# Altium schematic sheet T1_Card_Top.SchDoc
size 431 x 279 mm; Date: Not shown in title block; ApprovedBy: Not shown in title block; CheckedBy: Not shown in title block; Author: Not shown in title block; CompanyName: Not shown in title block; DrawnBy: Andy Lin (TI); Engineer: Not shown in title block; Organization: Not shown in title block; Address1: Not shown in title block; Address2: Not shown in title block; Address3: Not shown in title block; Address4: Not shown in title block; DocumentNumber: 2; Revision: Use project parameter SCH_Rev; SheetNumber: 2; SheetTotal: 14; PageSetup: Record=PageOptions|CenterHorizontal=True|CenterVertical=True|PrintScale=1.00|XCorrection=1.00|YCorrection=1.00|PrintKind=0|BorderSize=5000000|LeftOffset=0|BottomOffset=0|Orientation=2|PaperLength=1000|PaperWidth=1000|Scale=100|PaperSource=15|PrintQuality=600|MediaType=1|DitherType=10|PaperKind=Letter|PrintScaleMode=1; CurrentTime: Not shown in title block; CurrentDate: Not shown in title block; Time: Not shown in title block; DocumentFullPathAndName: Not shown in title block; DocumentName: Not shown in title block; ModifiedDate: Not shown in title block; ImagePath: Not shown in title block
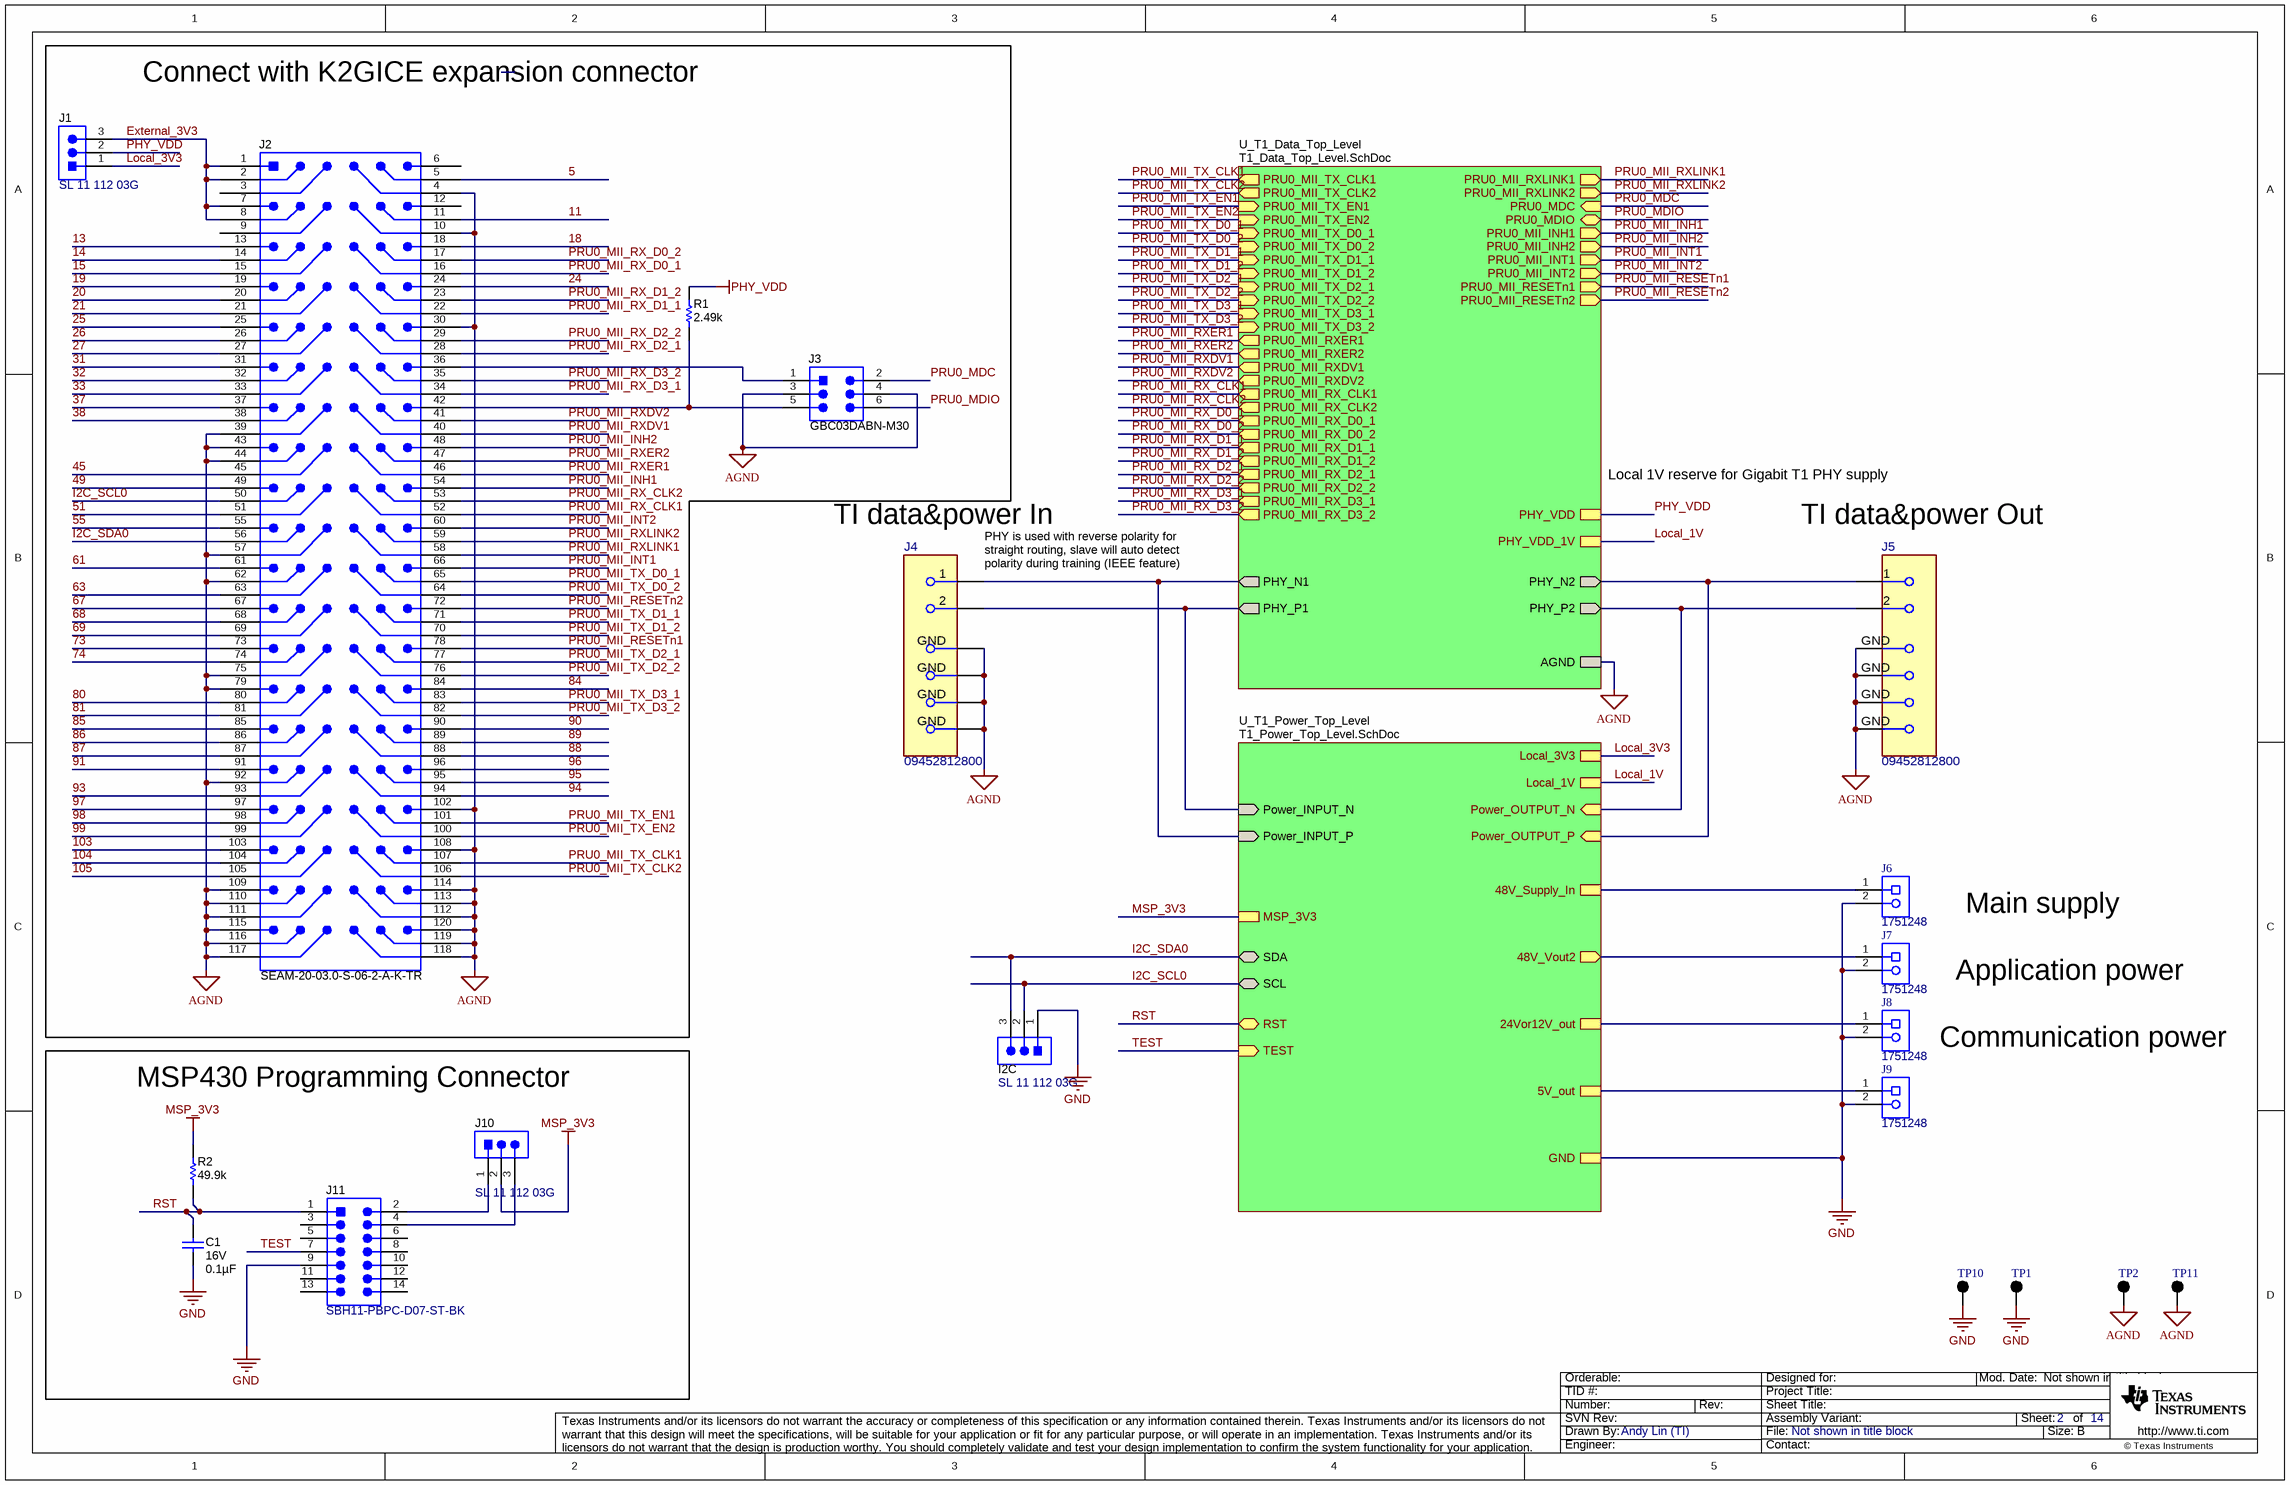
[diagram p0: T1_Card_Top.SchDoc]

## Parts
C1  VDC_V: 16V  ValueDisplayed: 0.1µF  [0402]  (hidden comment: GCM155R71C104JA55D)
I2C  SL 11 112 03G  [Fischer_SL-11-112-03G]
J1  SL 11 112 03G  [Fischer_SL-11-112-03G]
J2  SEAM-20-03.0-S-06-2-A-K-TR  [Samtec_SEAM-20-03_0-x-06-2-A-K]
J3  GBC03DABN-M30  [Sullins_GBC03DABN-M30]
J4  09452812800  [FP-09452812800_HDR2-MFG]
J5  09452812800  [FP-09452812800_HDR2-MFG]
J6  1751248  [CONN_1751248]
J7  1751248  [CONN_1751248]
J8  1751248  [CONN_1751248]
J9  1751248  [CONN_1751248]
J10  SL 11 112 03G  [Fischer_SL-11-112-03G]
J11  SBH11-PBPC-D07-ST-BK  [CONN_SBH11-PBPC-D07-ST-BK]
R1  ValueDisplayed: 2.49k  [0402]  (hidden comment: CRCW04022K49FKED)
R2  ValueDisplayed: 49.9k  [0402]  (hidden comment: CRCW040249K9FKED)
TP1  5001  [Keystone5001]  (value not drawn)
TP2  5001  [Keystone5001]  (value not drawn)
TP10  5001  [Keystone5001]  (value not drawn)
TP11  5001  [Keystone5001]  (value not drawn)

## Blocks framed on the sheet
Connect with K2GICE expansion connector: J1-J3 R1
MSP430 Programming Connector: C1 J10 J11 R2

## Sub-sheets
U_T1_Data_Top_Level = T1_Data_Top_Level.SchDoc: PHY_P1 (out), PHY_P2 (out), PHY_N1 (out), PHY_N2 (out), AGND, PHY_VDD, PRU0_MII_TX_D0_2 (in), PRU0_MII_TX_EN2 (in), PRU0_MII_TX_CLK1 (out), PRU0_MII_TX_D1_1 (in), PRU0_MII_TX_D1_2 (in), PRU0_MII_TX_CLK2 (out), PRU0_MII_TX_D0_1 (in), PRU0_MII_TX_EN1 (in), PRU0_MII_TX_D3_1 (in), PRU0_MII_TX_D3_2 (in), PRU0_MII_TX_D2_1 (in), PRU0_MII_TX_D2_2 (in), PRU0_MII_RXDV2 (out), PRU0_MII_RX_D2_1 (out), PRU0_MII_RXDV1 (out), PRU0_MII_RX_D0_1 (out), PRU0_MII_RX_D2_2 (out), PRU0_MII_RX_D3_1 (out), PRU0_MII_RX_D3_2 (out), PRU0_MII_RX_CLK1 (out), PRU0_MII_RX_D1_1 (out), PRU0_MII_RX_D1_2 (out), PRU0_MII_RXER1 (out), PRU0_MII_RX_D0_2 (out), PRU0_MII_RX_CLK2 (out), PRU0_MII_RXER2 (out), PRU0_MII_INT2 (out), PRU0_MII_INH1 (out), PRU0_MDC (in), PRU0_MII_INH2 (out), PRU0_MII_RESETn2 (out), PRU0_MII_RXLINK2 (out), PRU0_MDIO (bidir), PRU0_MII_RXLINK1 (out), PRU0_MII_INT1 (out), PRU0_MII_RESETn1 (out), PHY_VDD_1V
U_T1_Power_Top_Level = T1_Power_Top_Level.SchDoc: SCL (bidir), SDA (bidir), Power_INPUT_P (in), Power_INPUT_N (in), GND, Power_OUTPUT_P (in), Power_OUTPUT_N (in), 48V_Vout2 (out), RST (bidir), TEST (in), 24Vor12V_out, 5V_out, 48V_Supply_In, MSP_3V3, Local_3V3, Local_1V

## Nets
AGND: J2.4 J2.10 J2.30 J2.39 J2.43 J2.44 J2.57 J2.62 J2.75 J2.79 J2.92 J2.102 J2.108 J2.109 J2.110 J2.111 J2.112 J2.113 J2.114 J2.115 J2.116 J2.117 J2.118 J2.119 J2.120 J3.3 J3.4 J4.3(GND) J4.4(GND) J4.5(GND) J4.6(GND) J5.3(GND) J5.4(GND) J5.5(GND) J5.6(GND) TP2.1 TP11.1 ; sheet U_T1_Data_Top_Level/AGND
GND: C1.2 I2C.1 J6.2 J7.2 J8.2 J9.2 J11.9 TP1.1 TP10.1 ; sheet U_T1_Power_Top_Level/GND
MSP_3V3: J10.2 R2.2 ; sheet U_T1_Power_Top_Level/MSP_3V3
PHY_VDD: J1.2 R1.2 ; sheet U_T1_Data_Top_Level/PHY_VDD
5: J2.5
11: J2.11
13: J2.13
14: J2.14
15: J2.15
18: J2.18
19: J2.19
20: J2.20
21: J2.21
24: J2.24
25: J2.25
26: J2.26
27: J2.27
31: J2.31
32: J2.32
33: J2.33
37: J2.37
38: J2.38
45: J2.45
49: J2.49
51: J2.51
55: J2.55
61: J2.61
63: J2.63
67: J2.67
68: J2.68
69: J2.69
73: J2.73
74: J2.74
80: J2.80
81: J2.81
84: J2.84
85: J2.85
86: J2.86
87: J2.87
88: J2.88
89: J2.89
90: J2.90
91: J2.91
93: J2.93
94: J2.94
95: J2.95
96: J2.96
97: J2.97
98: J2.98
99: J2.99
103: J2.103
104: J2.104
105: J2.105
External_3V3: J1.3 J2.1 J2.2 J2.7 J2.8
I2C_SCL0: I2C.2 J2.50 ; sheet U_T1_Power_Top_Level/SCL
I2C_SDA0: I2C.3 J2.56 ; sheet U_T1_Power_Top_Level/SDA
Local_1V: sheet U_T1_Power_Top_Level/Local_1V, sheet U_T1_Data_Top_Level/PHY_VDD_1V
Local_3V3: J1.1 ; sheet U_T1_Power_Top_Level/Local_3V3
PRU0_MDC: J3.2 ; sheet U_T1_Data_Top_Level/PRU0_MDC
PRU0_MDIO: J3.6 ; sheet U_T1_Data_Top_Level/PRU0_MDIO
PRU0_MII_INH1: J2.54 ; sheet U_T1_Data_Top_Level/PRU0_MII_INH1
PRU0_MII_INH2: J2.48 ; sheet U_T1_Data_Top_Level/PRU0_MII_INH2
PRU0_MII_INT1: J2.66 ; sheet U_T1_Data_Top_Level/PRU0_MII_INT1
PRU0_MII_INT2: J2.60 ; sheet U_T1_Data_Top_Level/PRU0_MII_INT2
PRU0_MII_RESETn1: J2.78 ; sheet U_T1_Data_Top_Level/PRU0_MII_RESETn1
PRU0_MII_RESETn2: J2.72 ; sheet U_T1_Data_Top_Level/PRU0_MII_RESETn2
PRU0_MII_RX_CLK1: J2.52 ; sheet U_T1_Data_Top_Level/PRU0_MII_RX_CLK1
PRU0_MII_RX_CLK2: J2.53 ; sheet U_T1_Data_Top_Level/PRU0_MII_RX_CLK2
PRU0_MII_RX_D0_1: J2.16 ; sheet U_T1_Data_Top_Level/PRU0_MII_RX_D0_1
PRU0_MII_RX_D0_2: J2.17 ; sheet U_T1_Data_Top_Level/PRU0_MII_RX_D0_2
PRU0_MII_RX_D1_1: J2.22 ; sheet U_T1_Data_Top_Level/PRU0_MII_RX_D1_1
PRU0_MII_RX_D1_2: J2.23 ; sheet U_T1_Data_Top_Level/PRU0_MII_RX_D1_2
PRU0_MII_RX_D2_1: J2.28 ; sheet U_T1_Data_Top_Level/PRU0_MII_RX_D2_1
PRU0_MII_RX_D2_2: J2.29 ; sheet U_T1_Data_Top_Level/PRU0_MII_RX_D2_2
PRU0_MII_RX_D3_1: J2.34 ; sheet U_T1_Data_Top_Level/PRU0_MII_RX_D3_1
PRU0_MII_RX_D3_2: J2.35 ; sheet U_T1_Data_Top_Level/PRU0_MII_RX_D3_2
PRU0_MII_RXDV1: J2.40 ; sheet U_T1_Data_Top_Level/PRU0_MII_RXDV1
PRU0_MII_RXDV2: J2.41 ; sheet U_T1_Data_Top_Level/PRU0_MII_RXDV2
PRU0_MII_RXER1: J2.46 ; sheet U_T1_Data_Top_Level/PRU0_MII_RXER1
PRU0_MII_RXER2: J2.47 ; sheet U_T1_Data_Top_Level/PRU0_MII_RXER2
PRU0_MII_RXLINK1: J2.58 ; sheet U_T1_Data_Top_Level/PRU0_MII_RXLINK1
PRU0_MII_RXLINK2: J2.59 ; sheet U_T1_Data_Top_Level/PRU0_MII_RXLINK2
PRU0_MII_TX_CLK1: J2.107 ; sheet U_T1_Data_Top_Level/PRU0_MII_TX_CLK1
PRU0_MII_TX_CLK2: J2.106 ; sheet U_T1_Data_Top_Level/PRU0_MII_TX_CLK2
PRU0_MII_TX_D0_1: J2.65 ; sheet U_T1_Data_Top_Level/PRU0_MII_TX_D0_1
PRU0_MII_TX_D0_2: J2.64 ; sheet U_T1_Data_Top_Level/PRU0_MII_TX_D0_2
PRU0_MII_TX_D1_1: J2.71 ; sheet U_T1_Data_Top_Level/PRU0_MII_TX_D1_1
PRU0_MII_TX_D1_2: J2.70 ; sheet U_T1_Data_Top_Level/PRU0_MII_TX_D1_2
PRU0_MII_TX_D2_1: J2.77 ; sheet U_T1_Data_Top_Level/PRU0_MII_TX_D2_1
PRU0_MII_TX_D2_2: J2.76 ; sheet U_T1_Data_Top_Level/PRU0_MII_TX_D2_2
PRU0_MII_TX_D3_1: J2.83 ; sheet U_T1_Data_Top_Level/PRU0_MII_TX_D3_1
PRU0_MII_TX_D3_2: J2.82 ; sheet U_T1_Data_Top_Level/PRU0_MII_TX_D3_2
PRU0_MII_TX_EN1: J2.101 ; sheet U_T1_Data_Top_Level/PRU0_MII_TX_EN1
PRU0_MII_TX_EN2: J2.100 ; sheet U_T1_Data_Top_Level/PRU0_MII_TX_EN2
RST: C1.1 J11.1 R2.1 ; sheet U_T1_Power_Top_Level/RST
TEST: J11.7 ; sheet U_T1_Power_Top_Level/TEST
NetJ2_36: J2.36 J3.1
NetJ2_42: J2.42 J3.5 R1.1
NetJ4_1: J4.1 ; sheet U_T1_Power_Top_Level/Power_INPUT_P, sheet U_T1_Data_Top_Level/PHY_N1
NetJ4_2: J4.2 ; sheet U_T1_Power_Top_Level/Power_INPUT_N, sheet U_T1_Data_Top_Level/PHY_P1
NetJ5_1: J5.1 ; sheet U_T1_Power_Top_Level/Power_OUTPUT_P, sheet U_T1_Data_Top_Level/PHY_N2
NetJ5_2: J5.2 ; sheet U_T1_Power_Top_Level/Power_OUTPUT_N, sheet U_T1_Data_Top_Level/PHY_P2
NetJ6_1: J6.1 ; sheet U_T1_Power_Top_Level/48V_Supply_In
NetJ7_1: J7.1 ; sheet U_T1_Power_Top_Level/48V_Vout2
NetJ8_1: J8.1 ; sheet U_T1_Power_Top_Level/24Vor12V_out
NetJ9_1: J9.1 ; sheet U_T1_Power_Top_Level/5V_out
NetJ10_1: J10.1 J11.2
NetJ10_3: J10.3 J11.4

Not connected (* = marked no-connect by the designer): J2 3 6 9 12; J11 3 5 6 8 10 11 12 13 14

## Notes on the sheet
- Local 1V reserve for Gigabit T1 PHY supply
- (near J4) TI data&power In
- (near J4) PHY is used with reverse polarity for straight routing, slave will auto detect polarity during training (IEEE feature)
- (near J5) TI data&power Out
- Main supply
- Application power
- Communication power
- Drawn By:
- SVN Rev:
- Number:
- TID #:
- Orderable:
- Rev:
- Sheet Title:
- File:
- Project Title:
- Designed for:
- Assembly Variant:
- Mod. Date:
- Sheet:
- Size:
- of
- B
- http://www.ti.com
- Texas Instruments and/or its licensors do not warrant the accuracy or completeness of this specification or any information contained therein. Texas Instruments and/or its licensors do not warrant that this design will meet the specifications, will be suitable for your application or fit for any particular purpose, or will operate in an implementation. Texas Instruments and/or its licensors do not warrant that the design is production worthy. You should completely validate and test your design implementation to confirm the system functionality for your application.
- Engineer:
- Contact:
- © Texas Instruments

## Library data of the parts
C1 = CMP-0080702-1: CAP, CERM, 0.1 µF, 16 V,+/- 5%, X7R, AEC-Q200 Grade 1, 0402; Manufacturer: MuRata; Cap_F: 100nF; SizeAreaWB_mm2: 3; SizeArea_mm2: 0.5; AEC Qualified: Y; AEC Category: Q200; Value: 0.1uF; TaMax_C: 125°C; SizeZ_mm: 0.6; AEC Grade: 1; Polarized: N; TaMin_C: -55°C; U/M: EA; ComponentLink1Description: Datasheet link; RoHS: Y; Tolerance_%: 5%; Supplier 1: Digi-Key; PackageReference: 0402; Technology: Ceramic; PartNumber: GCM155R71C104JA55D; TempCo: X7R; Supplier Part Number 2: 81-GCM155R71C104JA5D; Supplier 2: Mouser; SizeY_mm: 0.5; Value2: 16V; ComponentLink1URL: https://search.murata.co.jp/Ceramy/image/img/A01X/G101/ENG/GCM155R71C104JA55-01.pdf; CompType: Capacitor; MountType: SMT; Supplier Part Number 1: 490-16433-1-ND; SizeX_mm: 1; Cap_Case: 0402
I2C J1 J10 = CMP-0075048-1: Header, 2.54mm, 3x1, Gold, TH; Manufacturer: Fischer Elektronik; CT: False; CNHeader: True; ComponentLink1URL: http://www.fischerelektronik.de/web_fischer/public/index.xhtml; Publisher: Texas Instruments; CompType: Header; PackageReference: TH, 3-Leads, Body 2.5x7.62mm, Pitch 2.54mm; LatestRevisionDate: 2017-07-12; ClassName: Header; MountType: TH; PartNumber: SL 11 112 03G; ComponentLink1Description: Datasheet URL
J2 = CMP-0075646-1: Header(shrouded), 1.27mm, 20x6, Gold, SMT; Manufacturer: Samtec; Gender: Male; Cert_UL: Y; Current_A: 1.8A; Voltage_V: 240V; CT: False; Row_Count: 6; ComponentLink1Description: Datasheet URL; RoHS: Y; Orientation: Vertical; PackageReference: Header(shrouded), 1.27mm, 20x6, SMT; Color: Black; PartNumber: SEAM-20-03.0-S-06-2-A-K-TR; PinCount: 120; Publisher: Texas Instruments; ContactFinish: Gold; Shrouded: Y; ComponentLink1URL: http://suddendocs.samtec.com/catalog_english/seam.pdf; LatestRevisionDate: 2017-07-12; CompType: Header; CNHeader: False; MountType: SMT
J3 = CMP-0054609-2: Header, 2.54mm, 3x2, Gold, Black, SMT; Manufacturer: Sullins Connector Solutions; Shrouded: N; Gender: Male; Voltage_V: 600V; Row_Count: 2; RowSpacing_mm: 2.54; Cert_UL: Y; Current_A: 3A; ComponentLink1URL: http://www.sullinscorp.com/images/C10059.pdf; ClassName: Header; Color: Black; RoHS: Y; MountType: SMT; Supplier 1: Digi-Key; PackageReference: Header, 2.54mm, 3x2, SMT; PinCount: 6; CompType: Header; PartNumber: GBC03DABN-M30; Orientation: Vertical; ComponentLink1Description: Datasheet URL; Supplier Part Number 1: S2351E-03-ND; Pitch_mm: 2.54; ContactFinish: Gold
J4 J5 = CMP-0087169-1: T1 Industrial jack AH IP20; Manufacturer: Harting Electronics; Shrouded: true; Row_Count: 1; ComponentLink1URL: https://forum.upverter.com/uploads/default/original/3X/d/e/dea2c31e5810f6c153b28b85ed7e997e71109f89.PDF; RoHS: UNKNOWN; PackageReference: HDR2; PartNumber: 09452812800; PinCount: 2; ComponentLink1Description: Datasheet; Symbol Name: SYM-09452812800
J6-J9 = CMP-0055473-1: Conn Term Block, 2POS, 3.5mm, TH; Manufacturer: Phoenix Contact; CNHeader: FALSE; Green_Lifecycle: Not Set; Green_REACh: Incomplete; CompType: Terminal Block; CT: TRUE; ComponentLink1URL: https://sps06.itg.ti.com/sites/KMS/crossdivteams/altium/docs/ComponentDatasheets/PhoenixContact_1751248.pdf; Supplier Part Number 2: 651-1751248; Publisher: Texas Instruments; Supplier 2: Mouser; RoHS: Y; MountType: TH; Green_EU RoHS-2: Incomplete; Supplier 1: Digi-Key; Green_EU RoHS: Incomplete; PackageReference: 11x8.5x7.3mm; LatestRevisionDate: 26/05/2017; PartNumber: 1751248; ComponentLink1Description: Datasheet URL; Supplier Part Number 1: 277-5719-ND
J11 = CMP-0054695-2: Header (shrouded), 100 mil, 7x2, Gold, TH; Manufacturer: Sullins Connector Solutions; Green_REACh: Incomplete; Green_Lifecycle: Not Set; ComponentLink1URL: http://www.sullinscorp.com/catalogs/145_11_SERIES,_.100_BOX_HEADER.pdf; Green_EU RoHS-2: Incomplete; Supplier 1: Digi-Key; PackageReference: 7x2 Shrouded Header; CompType: Header; RoHS: Y; Supplier Part Number 1: S9170-ND; MountType: TH; Green_EU RoHS: Incomplete; PartNumber: SBH11-PBPC-D07-ST-BK; ComponentLink1Description: Datasheet URL
R1 = CMP-0026237-2: RES, 2.49 k, 1%, 0.063 W, AEC-Q200 Grade 0, 0402; Manufacturer: Vishay-Dale; Power_W: 63mW; TempCo: 100 ppm/C; Value_Code: 2k49; Value: 2.49k; EIA_Code: E96; SizeX_mm: 1; SizeY_mm: 0.5; SizeZ_mm: 0.6; Value2: 0.063W; AEC Qualified: Y; VDC_V: 50V; AEC Category: Q200; AEC Grade: 0; ComponentLink1URL: http://www.vishay.com/docs/20035/dcrcwe3.pdf; Supplier Part Number 2: 52K6803; Supplier 2: Newark; Supplier Part Number 3: 71-CRCW0402-2.49K-E3; Supplier 3: Mouser; RoHS: E; Value1: 1%; MountType: SMT; Supplier 1: Digi-Key; PackageReference: 0402; Tolerance_%: 1%; Res_ohm: 2.49k; SizeArea_mm2: 0.5; CompType: Resistor; PartNumber: CRCW04022K49FKED; ComponentLink1Description: Datasheet link; Supplier Part Number 1: 541-2.49KLCT-ND; Technology: Thick Film
R2 = CMP-0026403-2: RES, 49.9 k, 1%, 0.063 W, AEC-Q200 Grade 0, 0402; Manufacturer: Vishay-Dale; Power_W: 63mW; TempCo: 100 ppm/C; Value_Code: 49k9; Value: 49.9k; EIA_Code: E96; SizeX_mm: 1; SizeY_mm: 0.5; SizeZ_mm: 0.6; Value2: 0.063W; AEC Qualified: Y; VDC_V: 50V; AEC Category: Q200; AEC Grade: 0; ComponentLink1URL: http://www.vishay.com/docs/20035/dcrcwe3.pdf; Supplier Part Number 2: 52K7113; Supplier 2: Newark; Supplier Part Number 3: 71-CRCW0402-49.9K-E3; Supplier 3: Mouser; RoHS: E; Value1: 1%; MountType: SMT; Supplier 1: Digi-Key; PackageReference: 0402; Tolerance_%: 1%; Res_ohm: 49.9k; SizeArea_mm2: 0.5; CompType: Resistor; PartNumber: CRCW040249K9FKED; ComponentLink1Description: Datasheet link; Supplier Part Number 1: 541-49.9KLCT-ND; Technology: Thick Film
TP1 TP2 TP10 TP11 = CMP-0055138-1: Test Point, Miniature, Black, TH; Manufacturer: Keystone; CNHeader: FALSE; Green_Lifecycle: Active; Green_REACh: Passed; ContactFinish: Silver; CT: TRUE; ComponentLink1URL: http://www.keyelco.com/userAssets/file/M60-2p60.pdf; Supplier Part Number 2: 534-5001; Publisher: Texas Instruments; Supplier 2: Mouser; Color: Black; RoHS: Y; MountType: TH; Green_EU RoHS-2: Incomplete; Supplier 1: Digi-Key; Green_EU RoHS: Passed; PackageReference: Black Miniature Testpoint; CompType: Test Point; LatestRevisionDate: 26/05/2017; PartNumber: 5001; ComponentLink1Description: Datasheet URL; Supplier Part Number 1: 36-5001-ND